# Altium schematic sheet 9v5_schem.SchDoc
size A4; SheetNumber: 1; SheetTotal: 1
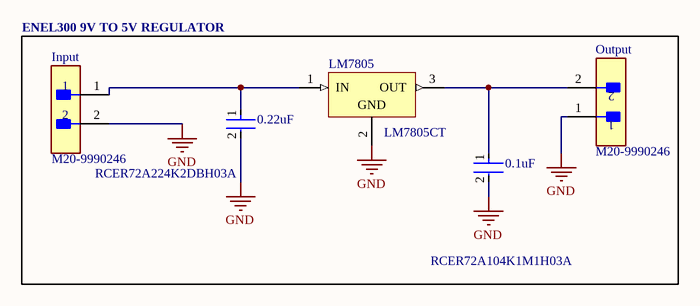
[diagram p0: 9v5_schem.SchDoc]

## Parts
0.1uF  RCER72A104K1M1H03A  [FP-RCE1K1-2_5-MFG]
0.22uF  RCER72A224K2DBH03A  [FP-RCE2A2-MFG]
Input  M20-9990246  [FP-M20-9990246-MFG]
LM7805  LM7805CT  [FAIR-TO-220-3]
Output  M20-9990246  [FP-M20-9990246-MFG]

## Blocks framed on the sheet
ENEL300 9V TO 5V REGULATOR: 0.1uF 0.22uF Input LM7805 Output

## Nets
GND: 0.1uF.2 0.22uF.2 Input.2 LM7805.2(GND) Output.1
Net0.1uF_1: 0.1uF.1 LM7805.3(OUT) Output.2
Net0.22uF_1: 0.22uF.1 Input.1 LM7805.1(IN)

## Library data of the parts
0.1uF = CMP-06035-028865-1: Cap Ceramic Monolithic 100nF 100V 10% Thru-Hole Bulk; Dielectric: X7R; Lead Diameter: 0.5mm; Lead/Base Style: Formed Leads; Height: 3.5mm; Lead Free: Lead Free; Voltage Rating: 100V; Min Operating Temperature: -55°C; Ratings: AEC-Q200; Voltage Rating (DC): 100V; Termination: Radial; Packaging: Tape and Reel; Package Quantity: 2000; Width: 0.098inch; Case/Package: Radial; Height - Seated (Max): 0.138inch; Capacitance: 100nF; Max Operating Temperature: 125°C; Resistor Type: Ceramic; Lead Pitch: 0.197inch; Tolerance: 10%; Length: 0.157inch; Mount: Through Hole; Value: 100nF
0.22uF = CMP-06035-010964-1: Cap Ceramic 220nF 100V X7R ±10% Radial 2.5mm +125°C Automotive Ammo Pack; Lead Diameter: 0.5mm; Lead/Base Style: Straight; Package Quantity: 2000; Capacitance: 220nF; Voltage Rating (DC): 100V; Resistor Type: Ceramic; Height - Seated (Max): 0.157inch; Termination: Radial; Tolerance: 10%; Min Operating Temperature: -55°C; Dielectric: X7R; Ratings: AEC-Q200; Max Operating Temperature: 125°C; Mount: Through Hole; Lead Pitch: 0.098inch; Length: 0.217inch; Case/Package: Radial; Packaging: Tape and Reel; Voltage Rating: 100V; Width: 0.124inch; Height: 4mm; Value: 220nF
Input Output = CMP-15831-000009-1: CONN HEADER VERT 2POS 2.54MM; Manufacturer: Harwin; Conn Gender: Male; Conn Orientation: Vertical; Number Of Contacts: 2; Current Rating: 3A; ComponentLink2URL: https://cdn.harwin.com/pdfs/M20-999.pdf; ComponentLink2Description: Datasheet; Package: M20-9990246; Temperature: -40°C to +105°C; Octopart: https://octopart.com/m20-9990246-harwin-2590635; Mouser Description: 2.54mm (0.1") Pitch SIL Vertical PC Tail Pin Header, 6.1mm mating pin height, tin, 2 contacts; Temperature Range High: +105°C; Device Class L1: Connectors; RoHS: TRUE; Automotive: No; Height: 8.99mm; Number Of Rows: 1; Contact Material: Tin,Nickel; Category: Conn; Pitch: 2.54mm; Lead Free: Yes; Digikey Description: CONN HEADER VERT 2POS 2.54MM; Manufacturer Part Number: M20-9990246; Temperature Range Low: -40°C; Device Class L3: unset; Device Class L2: Headers and Wire Housings
LM7805 = CMP-2000-04938-1: Positive Voltage Regulator, 5 V, 1 A, -40 to 125 degC, 3-Pin TO-220, RoHS, Tube; Manufacturer: FairchildSemiconductor; Maximum Input Voltage: 35V; Maximum Quiescent Current: 8mA; Load Regulation: 100mV; Maximum Output Current: 2.2(Typ)A; Output Type: Fixed; Typical Dropout Voltage @ Current: 2@1AV; Rad Hard: No; Output Voltage: 5V; Accuracy: ±4%; Number of Outputs: 1; Category: LinearRegulator; Package Description: 3-Pin Through Hole Device, Body 10 x 4.5 mm, Pitch 2.54 mm; Packaging: Rail/Tube; Mounting: ThroughHole; Polarity: Positive; Manufacturer URL: https://www.fairchildsemi.com/; Line Regulation: 100mV; Datasheet Version: Aug-12; Datasheet URL: https://datasheet.ciiva.com/26904/lm7805ct-26904988.pdf; Package Reference: TO-220; Package URL: https://www.fairchildsemi.com/package-drawings/TO/TO220B03.pdf; Package: 3TO-220AB; Operating Temperature: -40to125degC; Type: Linear